# Altium schematic sheet Control_Signals.SchDoc: Control Signals
size 292 x 193 mm; SheetNumber: 5; SheetTotal: 9
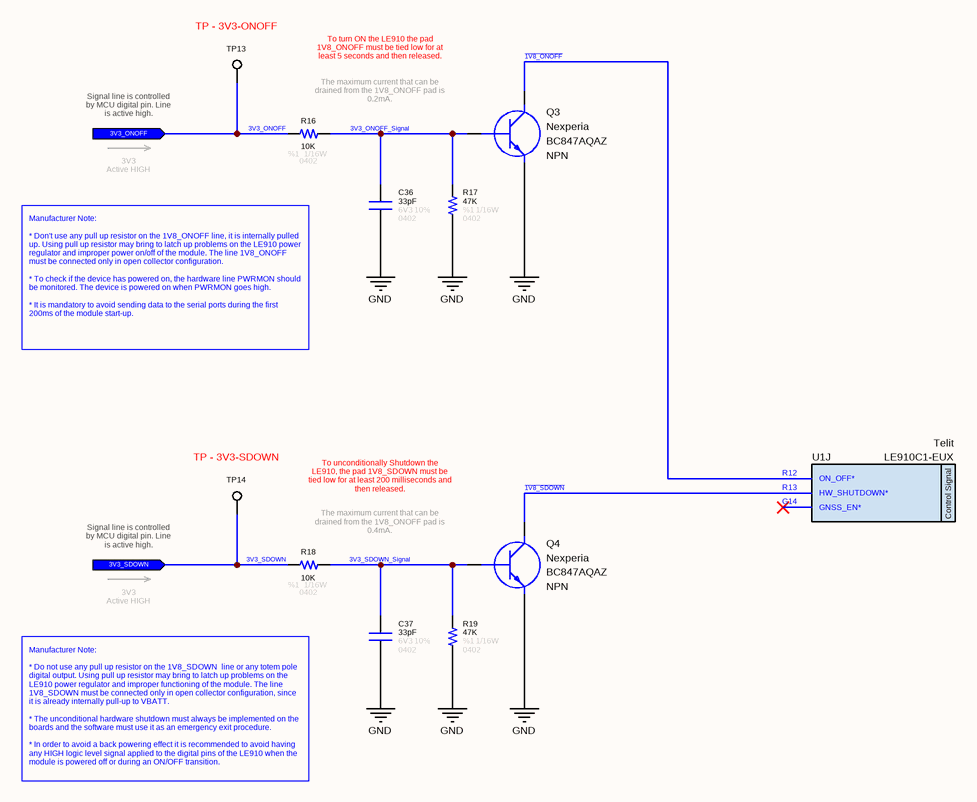
[diagram p0: Control_Signals.SchDoc]

## Parts
C36  value 33pF  Tolerance: 10%  Case: 0402  Voltage: 6V3  [CAPACITOR_0402]  (hidden comment: Capacitor - 33pF [0402] (Ceramic))
C37  value 33pF  Tolerance: 10%  Case: 0402  Voltage: 6V3  [CAPACITOR_0402]  (hidden comment: Capacitor - 33pF [0402] (Ceramic))
Q3  Manufacturer Name: Nexperia  Polarity: NPN  [SOT1215]  (hidden comment: BC847AQAZ)
Q4  Manufacturer Name: Nexperia  Polarity: NPN  [SOT1215]  (hidden comment: BC847AQAZ)
R16  value 10K  Tolerance: %1  Case: 0402  Power: 1/16W  [RESISTOR_0402]  (hidden comment: 10K - 0402 - %1 - 1/16W)
R17  value 47K  Tolerance: %1  Case: 0402  Power: 1/16W  [RESISTOR_0402]  (hidden comment: 47K - 0402 - %1 - 1/16W)
R18  value 10K  Tolerance: %1  Case: 0402  Power: 1/16W  [RESISTOR_0402]  (hidden comment: 10K - 0402 - %1 - 1/16W)
R19  value 47K  Tolerance: %1  Case: 0402  Power: 1/16W  [RESISTOR_0402]  (hidden comment: 47K - 0402 - %1 - 1/16W)
TP13  TP - 3V3-ONOFF  [TP]  (no BOM)
TP14  TP - 3V3-SDOWN  [TP]  (no BOM)
U1  Manufacturer Part Number: LE910C1-EUX  Manufacturer Name: Telit  [LE910 GSM Modem]  (hidden comment: LE910C1-EUX LTE GSM Module)  (part J of 19)

## Ports
3V3_ONOFF (in), 3V3_SDOWN (in)

## Nets
GND: C36.1 C37.1 Q3.2(E) Q4.2(E) R17.1 R19.1
~{1V8_ONOFF}: Q3.3(C) U1.R12(ON_OFF*)
~{1V8_SDOWN}: Q4.3(C) U1.R13(HW_SHUTDOWN*)
3V3_ONOFF: R16.2 TP13.1 ; port 3V3_ONOFF
3V3_ONOFF_Signal: C36.2 Q3.1(B) R16.1 R17.2
3V3_SDOWN: R18.2 TP14.1 ; port 3V3_SDOWN
3V3_SDOWN_Signal: C37.2 Q4.1(B) R18.1 R19.2

Not connected (* = marked no-connect by the designer): U1 G14(GNSS_EN*)*

## Notes on the sheet
- To turn ON the LE910 the pad 1V8_ONOFF must be tied low for at least 5 seconds and then released.
- Signal line is controlled by MCU digital pin. Line is active high.
- The maximum current that can be drained from the 1V8_ONOFF pad is 0.2mA.
- 3V3
  Active HIGH
- Manufacturer Note:
  * Don't use any pull up resistor on the 1V8_ONOFF line, it is internally pulled up. Using pull up resistor may bring to latch up problems on the LE910 power regulator and improper power on/off of the module. The line 1V8_ONOFF must be connected only in open collector configuration.
  * To check if the device has powered on, the hardware line PWRMON should be monitored. The device is powered on when PWRMON goes high.
  * It is mandatory to avoid sending data to the serial ports during the first 200ms of the module start-up.
- To unconditionally Shutdown the LE910, the pad 1V8_SDOWN must be tied low for at least 200 milliseconds and then released.
- The maximum current that can be drained from the 1V8_ONOFF pad is 0.4mA.
- Manufacturer Note:
  * Do not use any pull up resistor on the 1V8_SDOWN  line or any totem pole digital output. Using pull up resistor may bring to latch up problems on the LE910 power regulator and improper functioning of the module. The line 1V8_SDOWN must be connected only in open collector configuration, since it is already internally pull-up to VBATT.
  * The unconditional hardware shutdown must always be implemented on the boards and the software must use it as an emergency exit procedure.
  * In order to avoid a back powering effect it is recommended to avoid having any HIGH logic level signal applied to the digital pins of the LE910 when the module is powered off or during an ON/OFF transition.
- © 2026 All rights reserved.
  This document may not, in whole or in part, be copied, photocopied, reproduced, translated or converted to any electronic or machine readable from without prior written permission of Mehmet Günce Akkoyun.
  Engineer contact : akkoyun@me.com
- Property of
- Engineer :
- Date :
- Size :
- A4
- Time :
- Project :
- Page :
- /
- Customer :
- Product ID :
- Module ID :
- Version :
- File :
- Revision :
- (in symbol IC - LE910C1-EUX, part J) Control Signal

## Library data of the parts
C36 C37 = Capacitor - 33pF [0402-6V3]: Manufacturer Name: Kemet; Manufacturer Part Number: C0402C330J9RACAUTO; ComponentLink1Description: DataSheet; ComponentLink1URL: https://api.kemet.com/component-edge/download/datasheet/C0402C330J9RACAUTO.pdf; ComponentLink2Description: Mouser; ComponentLink2URL: https://www.mouser.com/Search/Refine.aspx?Keyword=80-C0402C330J9RAUTO
Q3 Q4 = Transistor - BC847: Bipolar NPN Transistors; Case: DFN-1010D-3; Manufacturer Part Number: BC847AQAZ
R16 R18 = Resistor - 10K [0402]: Thick Film Resistors - SMD 1/16 W 10 KOhm 1%; Manufacturer Name: Vishay; Manufacturer Part Number: CRCW040210K0FKED; ComponentLink1Description: DataSheet; ComponentLink1URL: https://www.mouser.com.tr/datasheet/2/427/dcrcwe3-1762152.pdf; ComponentLink2Description: Mouser; ComponentLink2URL: https://www.mouser.com.tr/ProductDetail/Vishay-Dale/CRCW040210K0FKED?qs=sGAEpiMZZMu61qfTUdNhG2DpbjADlD3GcalbOv9utCY%3D
R17 R19 = Resistor - 47K [0402]: Thick Film Resistors - SMD 1/16 W 47 KOhm 1%; Manufacturer Name: Vishay; Manufacturer Part Number: CRCW040247K0FKED; ComponentLink1Description: DataSheet; ComponentLink1URL: https://www.mouser.com.tr/datasheet/2/427/dcrcwe3-1762152.pdf; ComponentLink2Description: Mouser; ComponentLink2URL: https://www.mouser.com.tr/ProductDetail/Vishay-Dale/CRCW040247K0FKED?qs=sGAEpiMZZMu61qfTUdNhG2DpbjADlD3GL%252B3h1elTxqU%3D
TP13 TP14 = PCB - Test Point: Test Point
U1 = IC - LE910C1-EUX: Telit LE910C1-EUX LTE/2G GSM Module; Case: BGA